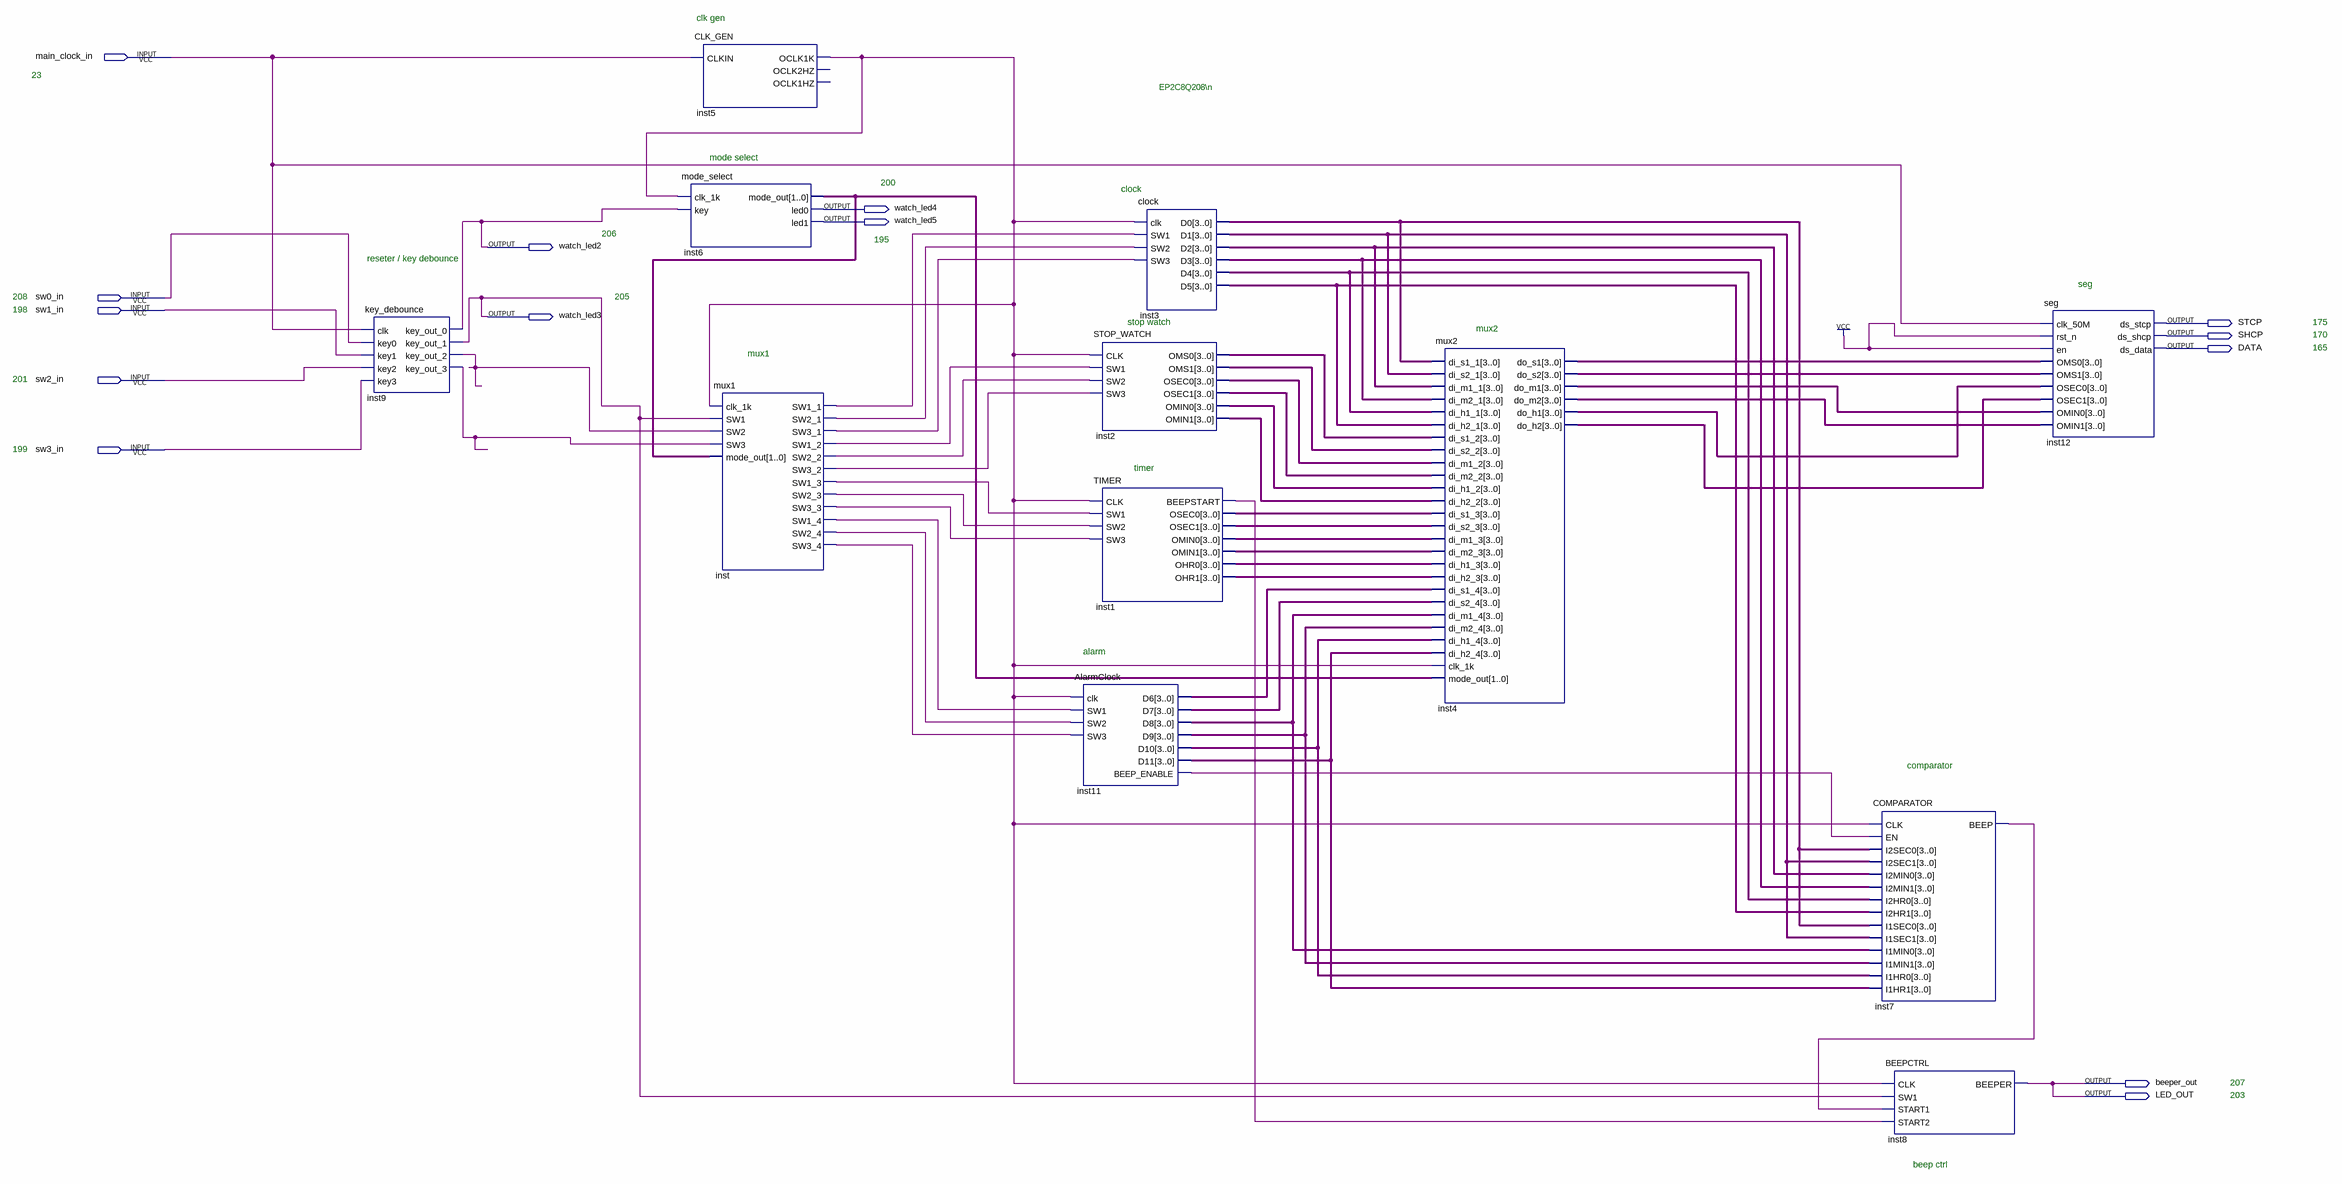
[diagram p0: schematic sheet]
// Quartus schematic VHDL_clock.bdf as structural Verilog: 12 symbols, 14 pins
module VHDL_clock (
  input  main_clock_in,
  input  sw0_in,
  input  sw1_in,
  input  sw2_in,
  input  sw3_in,
  output watch_led4,
  output watch_led5,
  output watch_led2,
  output watch_led3,
  output STCP,
  output SHCP,
  output DATA,
  output beeper_out,
  output LED_OUT
);

  wire inst1_beepstart, inst5_oclk1k, inst7_beep, inst9_key_out_2, inst9_key_out_3, inst11_beep_enable,
       inst_sw1_1, inst_sw1_2, inst_sw1_3, inst_sw1_4, inst_sw2_1, inst_sw2_2, inst_sw2_3, inst_sw2_4,
       inst_sw3_1, inst_sw3_2, inst_sw3_3, inst_sw3_4;
  wire [1:0] inst6_mode_out;
  wire [3:0] inst1_ohr0, inst1_ohr1, inst1_omin0, inst1_omin1, inst1_osec0, inst1_osec1, inst2_omin0,
       inst2_omin1, inst2_oms0, inst2_oms1, inst2_osec0, inst2_osec1, inst3_d0, inst3_d1, inst3_d2, inst3_d3,
       inst3_d4, inst3_d5, inst4_do_h1, inst4_do_h2, inst4_do_m1, inst4_do_m2, inst4_do_s1, inst4_do_s2,
       inst11_d6, inst11_d7, inst11_d8, inst11_d9, inst11_d10, inst11_d11;

  key_debounce inst9 (
    .clk(main_clock_in), .key0(sw0_in), .key1(sw1_in), .key2(sw2_in), .key3(sw3_in), .key_out_0(watch_led2),
    .key_out_1(watch_led3), .key_out_2(inst9_key_out_2), .key_out_3(inst9_key_out_3));
  CLK_GEN inst5 (.CLKIN(main_clock_in), .OCLK1K(inst5_oclk1k));  // open: OCLK2HZ, OCLK1HZ
  mode_select inst6 (
    .clk_1k(inst5_oclk1k), .key(watch_led2), .mode_out(inst6_mode_out), .led0(watch_led4), .led1(watch_led5));
  mux1 inst (
    .clk_1k(inst5_oclk1k), .SW1(watch_led3), .SW2(inst9_key_out_2), .SW3(inst9_key_out_3),
    .mode_out(inst6_mode_out), .SW1_1(inst_sw1_1), .SW2_1(inst_sw2_1), .SW3_1(inst_sw3_1),
    .SW1_2(inst_sw1_2), .SW2_2(inst_sw2_2), .SW3_2(inst_sw3_2), .SW1_3(inst_sw1_3), .SW2_3(inst_sw2_3),
    .SW3_3(inst_sw3_3), .SW1_4(inst_sw1_4), .SW2_4(inst_sw2_4), .SW3_4(inst_sw3_4));
  STOP_WATCH inst2 (
    .CLK(inst5_oclk1k), .SW1(inst_sw1_2), .SW2(inst_sw2_2), .SW3(inst_sw3_2), .OMS0(inst2_oms0),
    .OMS1(inst2_oms1), .OSEC0(inst2_osec0), .OSEC1(inst2_osec1), .OMIN0(inst2_omin0), .OMIN1(inst2_omin1));
  TIMER inst1 (
    .CLK(inst5_oclk1k), .SW1(inst_sw1_3), .SW2(inst_sw2_3), .SW3(inst_sw3_3), .BEEPSTART(inst1_beepstart),
    .OSEC0(inst1_osec0), .OSEC1(inst1_osec1), .OMIN0(inst1_omin0), .OMIN1(inst1_omin1), .OHR0(inst1_ohr0),
    .OHR1(inst1_ohr1));
  AlarmClock inst11 (
    .clk(inst5_oclk1k), .SW1(inst_sw1_4), .SW2(inst_sw2_4), .SW3(inst_sw3_4), .D6(inst11_d6), .D7(inst11_d7),
    .D8(inst11_d8), .D9(inst11_d9), .D10(inst11_d10), .D11(inst11_d11), .BEEP_ENABLE(inst11_beep_enable));
  clock inst3 (
    .clk(inst5_oclk1k), .SW1(inst_sw1_1), .SW2(inst_sw2_1), .SW3(inst_sw3_1), .D0(inst3_d0), .D1(inst3_d1),
    .D2(inst3_d2), .D3(inst3_d3), .D4(inst3_d4), .D5(inst3_d5));
  mux2 inst4 (
    .di_s1_1(inst3_d0), .di_s2_1(inst3_d1), .di_m1_1(inst3_d2), .di_m2_1(inst3_d3), .di_h1_1(inst3_d4),
    .di_h2_1(inst3_d5), .di_s1_2(inst2_oms0), .di_s2_2(inst2_oms1), .di_m1_2(inst2_osec0),
    .di_m2_2(inst2_osec1), .di_h1_2(inst2_omin0), .di_h2_2(inst2_omin1), .di_s1_3(inst1_osec0),
    .di_s2_3(inst1_osec1), .di_m1_3(inst1_omin0), .di_m2_3(inst1_omin1), .di_h1_3(inst1_ohr0),
    .di_h2_3(inst1_ohr1), .di_s1_4(inst11_d6), .di_s2_4(inst11_d7), .di_m1_4(inst11_d8), .di_m2_4(inst11_d9),
    .di_h1_4(inst11_d10), .di_h2_4(inst11_d11), .clk_1k(inst5_oclk1k), .mode_out(inst6_mode_out),
    .do_s1(inst4_do_s1), .do_s2(inst4_do_s2), .do_m1(inst4_do_m1), .do_m2(inst4_do_m2), .do_h1(inst4_do_h1),
    .do_h2(inst4_do_h2));
  COMPARATOR inst7 (
    .CLK(inst5_oclk1k), .EN(inst11_beep_enable), .I2SEC0(inst3_d0), .I2SEC1(inst3_d1), .I2MIN0(inst3_d2),
    .I2MIN1(inst3_d3), .I2HR0(inst3_d4), .I2HR1(inst3_d5), .I1SEC0(inst3_d0), .I1SEC1(inst3_d1),
    .I1MIN0(inst11_d8), .I1MIN1(inst11_d9), .I1HR0(inst11_d10), .I1HR1(inst11_d11), .BEEP(inst7_beep));
  BEEPCTRL inst8 (
    .CLK(inst5_oclk1k), .SW1(watch_led3), .START1(inst7_beep), .START2(inst1_beepstart), .BEEPER(beeper_out));
  seg inst12 (
    .clk_50M(main_clock_in), .rst_n(1'b1), .en(1'b1), .OMS0(inst4_do_s1), .OMS1(inst4_do_s2),
    .OSEC0(inst4_do_h1), .OSEC1(inst4_do_h2), .OMIN0(inst4_do_m1), .OMIN1(inst4_do_m2), .ds_stcp(STCP),
    .ds_shcp(SHCP), .ds_data(DATA));

  assign LED_OUT = beeper_out;

  // Notes on the sheet:
  //   clk gen
  //   23
  //   EP2C8Q208\n
  //   mode select
  //   200
  //   clock
  //   206
  //   195
  //   reseter / key debounce
  //   seg
  //   208
  //   205
  //   198
  //   stop watch
  //   175
  //   mux2
  //   170
  //   165
  //   mux1
  //   201
  //   199
  //   timer
  //   alarm
  //   comparator
  //   207
  //   203
  //   beep ctrl
endmodule
